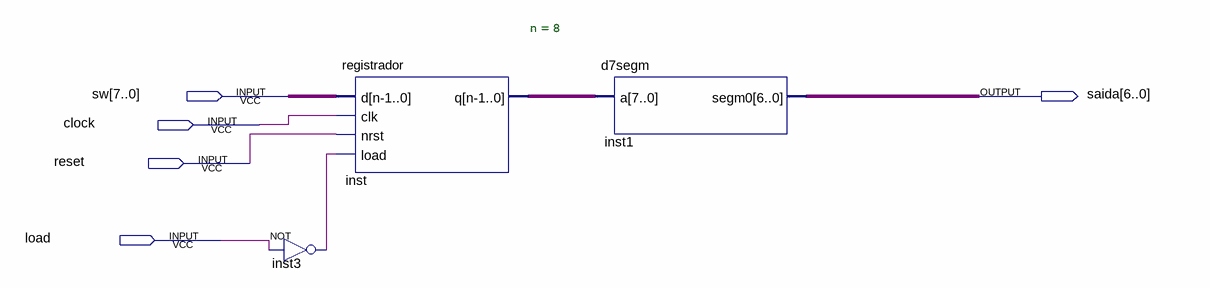
[diagram p0: schematic sheet]
// Quartus schematic resgistrador_top.bdf as structural Verilog: 3 symbols, 5 pins
module resgistrador_top (
  input  [7:0] sw,
  input  clock,
  input  reset,
  input  load,
  output [6:0] saida
);

  wire inst3_out;
  wire [7:0] inst_q;

  not inst3 (inst3_out, load);
  registrador #(.n(8)) inst (.d(sw), .clk(clock), .nrst(reset), .load(inst3_out), .q(inst_q));
  d7segm inst1 (.a(inst_q), .segm0(saida));
endmodule
